# Altium schematic sheet Ring 5_C.SchDoc
size A; DocumentNumber: 15; SheetNumber: 24; SheetTotal: 30
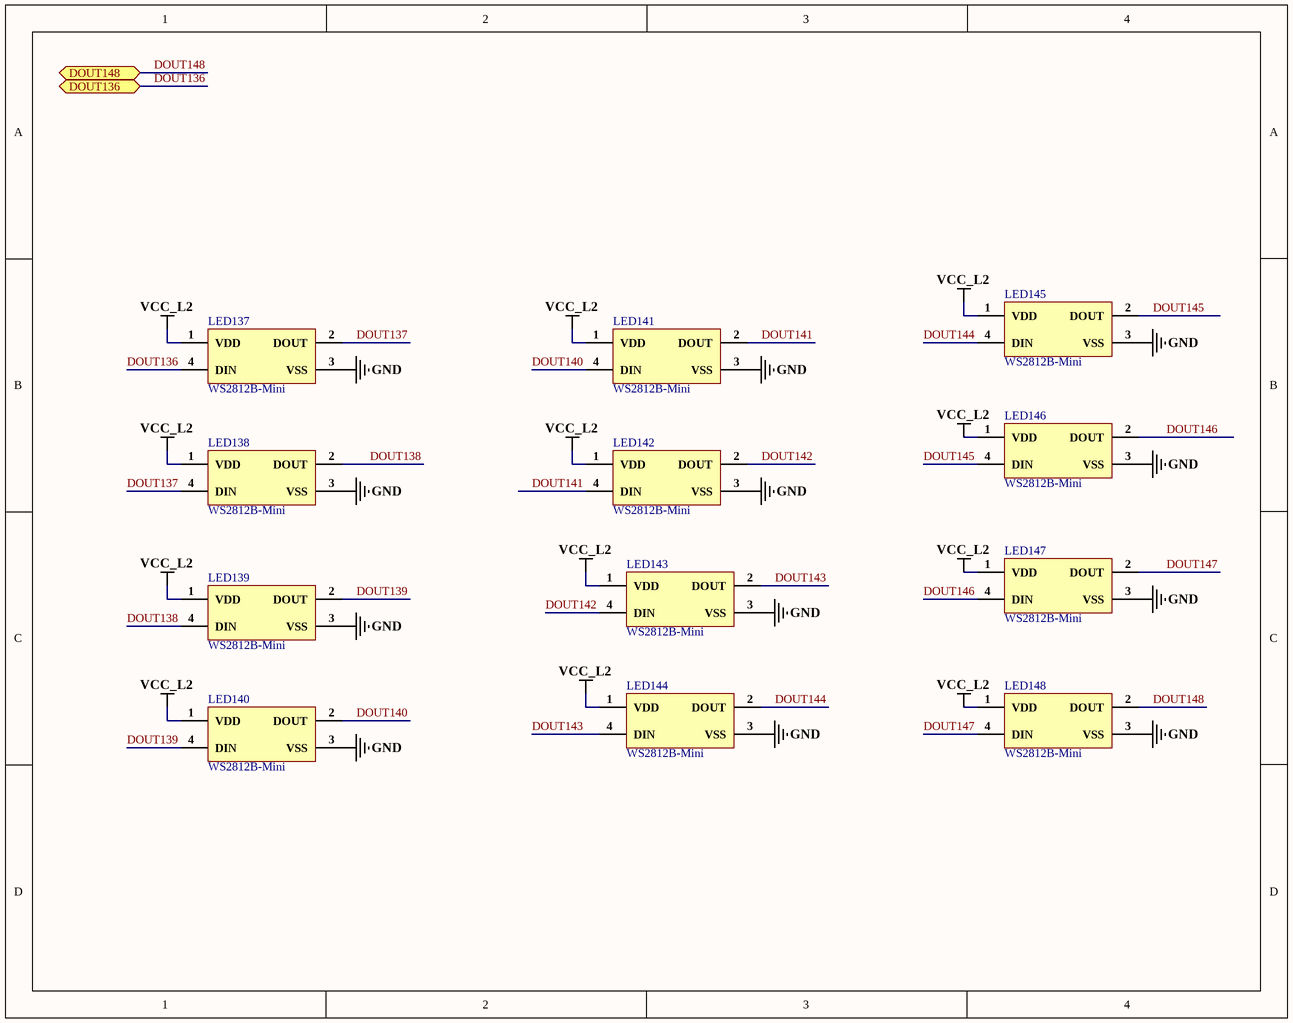
[diagram p0: Ring 5_C.SchDoc]

## Parts
LED137  WS2812B-Mini  [WS2812B-Mini]
LED138  WS2812B-Mini  [WS2812B-Mini]
LED139  WS2812B-Mini  [WS2812B-Mini]
LED140  WS2812B-Mini  [WS2812B-Mini]
LED141  WS2812B-Mini  [WS2812B-Mini]
LED142  WS2812B-Mini  [WS2812B-Mini]
LED143  WS2812B-Mini  [WS2812B-Mini]
LED144  WS2812B-Mini  [WS2812B-Mini]
LED145  WS2812B-Mini  [WS2812B-Mini]
LED146  WS2812B-Mini  [WS2812B-Mini]
LED147  WS2812B-Mini  [WS2812B-Mini]
LED148  WS2812B-Mini  [WS2812B-Mini]

## Ports
DOUT136 (bidir), DOUT148 (bidir)

## Nets
GND: LED137.3(VSS) LED138.3(VSS) LED139.3(VSS) LED140.3(VSS) LED141.3(VSS) LED142.3(VSS) LED143.3(VSS) LED144.3(VSS) LED145.3(VSS) LED146.3(VSS) LED147.3(VSS) LED148.3(VSS)
VCC_L2: LED137.1(VDD) LED138.1(VDD) LED139.1(VDD) LED140.1(VDD) LED141.1(VDD) LED142.1(VDD) LED143.1(VDD) LED144.1(VDD) LED145.1(VDD) LED146.1(VDD) LED147.1(VDD) LED148.1(VDD)
DOUT136: LED137.4(DIN) ; port DOUT136
DOUT137: LED137.2(DOUT) LED138.4(DIN)
DOUT138: LED138.2(DOUT) LED139.4(DIN)
DOUT139: LED139.2(DOUT) LED140.4(DIN)
DOUT140: LED140.2(DOUT) LED141.4(DIN)
DOUT141: LED141.2(DOUT) LED142.4(DIN)
DOUT142: LED142.2(DOUT) LED143.4(DIN)
DOUT143: LED143.2(DOUT) LED144.4(DIN)
DOUT144: LED144.2(DOUT) LED145.4(DIN)
DOUT145: LED145.2(DOUT) LED146.4(DIN)
DOUT146: LED146.2(DOUT) LED147.4(DIN)
DOUT147: LED147.2(DOUT) LED148.4(DIN)
DOUT148: LED148.2(DOUT) ; port DOUT148

## Library data of the parts
LED137-LED148 = WS2812B-Mini: SMD,3.5x3.5mm Light Emitting Diodes (LED) RoHS; Manufacturer: Worldsemi; ComponentLink1Description: LCSC; ComponentLink1URL: *https://lcsc.com/product-detail/Light-Emitting-Diodes-LED_Worldsemi-WS2812B-Mini_C527089.html; Package: SMD,3.5x3.5mm; Parameter 1: *